# EAGLE design TSAL_3_5_16 (EAGLE 7.5.0)
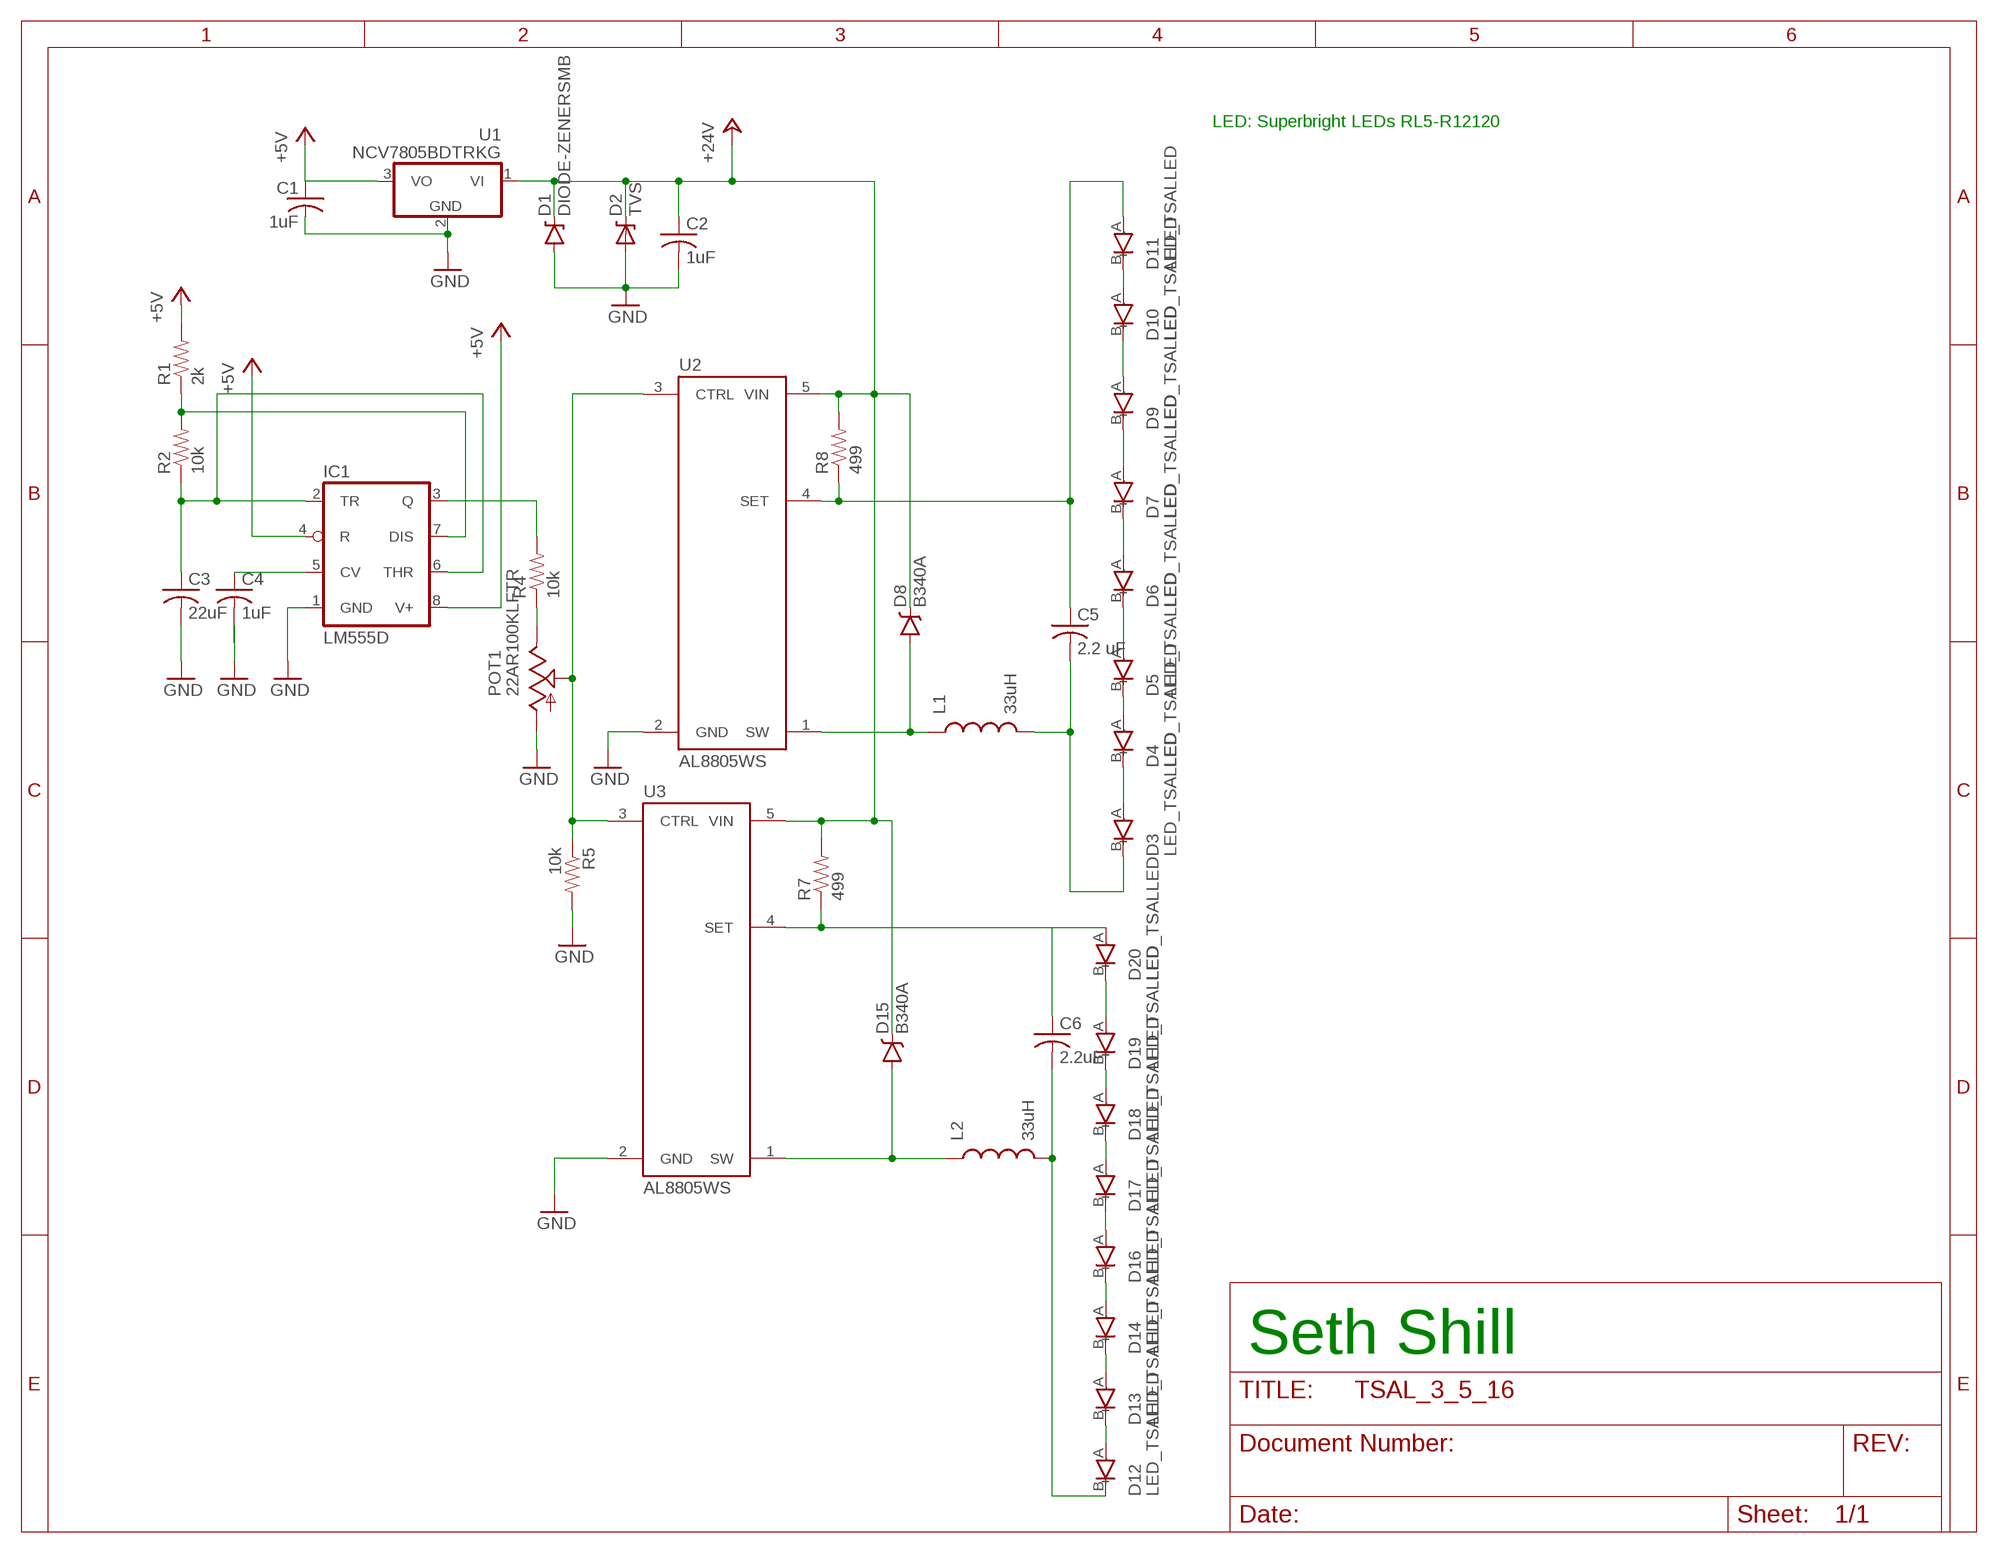
[diagram p0: schematic, sheet 1]

## Parts
C1  1uF  CAP_1UF_50V_0805  [0805@1]
C2  1uF  CAP_1UF_50V_0805  [0805@1]
C3  22uF  CAP_22UF_6.3V_0805  [0805@1]
C4  1uF  CAP_1UF_50V_0805  [0805@1]
C5  2.2 uF  CAP_2.2UF_16V_0603  [0603@1]
C6  2.2uF  CAP_2.2UF_16V_0603  [0603@1]
D1  DIODE-ZENERSMB  [SMB-DIODE]
D2  TVS  [DO-214AC]
D3  LED_TSALLED  [LED_TSAL]
D4  LED_TSALLED  [LED_TSAL]
D5  LED_TSALLED  [LED_TSAL]
D6  LED_TSALLED  [LED_TSAL]
D7  LED_TSALLED  [LED_TSAL]
D8  B340A  DIODE-SCHOTTKY-B340A  [SMA-DIODE]
D9  LED_TSALLED  [LED_TSAL]
D10  LED_TSALLED  [LED_TSAL]
D11  LED_TSALLED  [LED_TSAL]
D12  LED_TSALLED  [LED_TSAL]
D13  LED_TSALLED  [LED_TSAL]
D14  LED_TSALLED  [LED_TSAL]
D15  B340A  DIODE-SCHOTTKY-B340A  [SMA-DIODE]
D16  LED_TSALLED  [LED_TSAL]
D17  LED_TSALLED  [LED_TSAL]
D18  LED_TSALLED  [LED_TSAL]
D19  LED_TSALLED  [LED_TSAL]
D20  LED_TSALLED  [LED_TSAL]
IC1  LM555D  [SO08]
L1  33uH  INDUCTOR1007  [1007]
L2  33uH  INDUCTOR1007  [1007]
POT1  22AR100KLFTR  [22AR100KLFTR]
R1  2k  RES_2K_1%_0805  [0805@1]
R2  10k  RES_10K_1%_0805  [0805@1]
R4  10k  RES_10K_1%_0805  [0805@1]
R5  10k  RES_10K_1%_0805  [0805@1]
R7  499  RES_499_1%  [0603@1]
R8  499  RES_499_1%  [0603@1]
U1  NCV7805BDTRKG  [DPAK]
U2  AL8805WS  AL8805  [SOT23-5]
U3  AL8805WS  AL8805  [SOT23-5]

## Nets
+5V: C1.1(+) IC1.4(R) IC1.8(V+) R1.2 U1.3(VO)
+24V: C2.1(+) D1.C D2.C D8.C D15.C R7.2 R8.2 U1.1(VI) U2.5(VIN) U3.5(VIN)
GND: C1.2(-) C2.2(-) C3.2(-) C4.2(-) D1.A D2.A IC1.1(GND) POT1.3(CW) R5.2 U1.2(GND) U2.2(GND) U3.2(GND)
N$1: C6.1(+) D20.A(+) R7.1 U3.4(SET)
N$2: POT1.2(W) R5.1 U2.3(CTRL) U3.3(CTRL)
N$3: D17.A(+) D18.B(-)
N$4: C4.1(+) IC1.5(CV)
N$5: IC1.7(DIS) R1.1 R2.2
N$7: D15.A L2.1 U3.1(SW)
N$8: C5.1(+) D11.A(+) R8.1 U2.4(SET)
N$9: D10.A(+) D11.B(-)
N$10: C3.1(+) IC1.2(TR) IC1.6(THR) R2.1
N$11: D18.A(+) D19.B(-)
N$12: D9.A(+) D10.B(-)
N$13: D7.A(+) D9.B(-)
N$14: C6.2(-) D12.B(-) L2.2
N$15: D6.A(+) D7.B(-)
N$16: D5.A(+) D6.B(-)
N$17: D19.A(+) D20.B(-)
N$18: D12.A(+) D13.B(-)
N$19: C5.2(-) D3.B(-) L1.2
N$20: D13.A(+) D14.B(-)
N$21: D16.A(+) D17.B(-)
N$22: D14.A(+) D16.B(-)
N$23: D4.A(+) D5.B(-)
N$24: D3.A(+) D4.B(-)
N$26: D8.A L1.1 U2.1(SW)
N$27: POT1.1(CCW) R4.1
N$28: IC1.3(Q) R4.2

## Notes on the sheet
- LED: Superbright LEDs RL5-R12120
- Seth Shill

## Library data of the parts
C1 C2 C4 = FSAE Electric:CAP; PARTNO: UMK212F105ZG-T
C3 = FSAE Electric:CAP; PARTNO: CL21A226MQCLQNC
C5 C6 = FSAE Electric:CAP; PARTNO: EMK107F225ZA-T
D1 = FSAE Electric:DIODE-ZENER: Zener Diode Production Part - 8199 3.4V Zener Voltage
D2 = FSAE Electric:TVS: Diode
D3-D7 D9-D14 D16-D20 = FSAE Electric:LED_TSAL
D8 D15 = FSAE Electric:DIODE-SCHOTTKY: Schottky diodes in SFE's production catalog BAT20J 1A 23V 0.62Vf RB751 120mA 40V 0.37Vf PMEG4005EJ 0.5A 40V 0.42Vf MBRA140 1A 40V 0.5Vf B340A 3A 40V SMA; PROD_ID: DIO-09886
IC1 = FSAE Electric:*555: TIMER
L1 L2 = FSAE Electric:INDUCTOR: Inductors Basic Inductor/Choke - 0603 and 1206. Footprints are not proven and vary greatly between part numbers. INDUCTOR POWER 3.3UH 4.0A SMD 0.197" L x 0.197" W x 0.177" H (5.00mm x 5.00mm x 4.50mm); PARTNO: CB2518T330K
POT1 = FSAE Electric:22AR100KLFTR; PARTNO: 22AR100KLFTR
R1 = FSAE Electric:RES: Resistors; PARTNO: RC0805FR-072KL
R2 R4 R5 = FSAE Electric:RES: Resistors; PARTNO: RC0805FR-0710KL
R7 R8 = FSAE Electric:RES: Resistors; PARTNO: RC0603FR-07499RL
U1 = FSAE Electric:NCV7805BDTRKG; PARTNO: NCV7805BDTRKG
U2 U3 = FSAE Electric:AL8805: Constant current LED driver PWM-able 1MHz switch freq 6V-36V Up to 1A LED current; PROD_ID: IC-11626

## Board
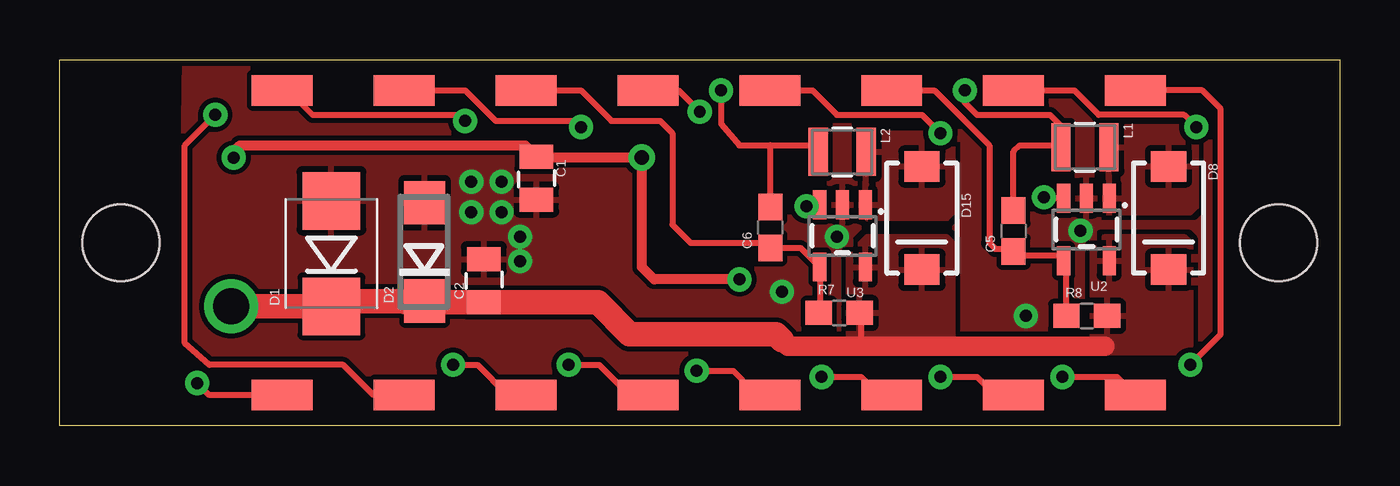
[diagram p1: board, top side]
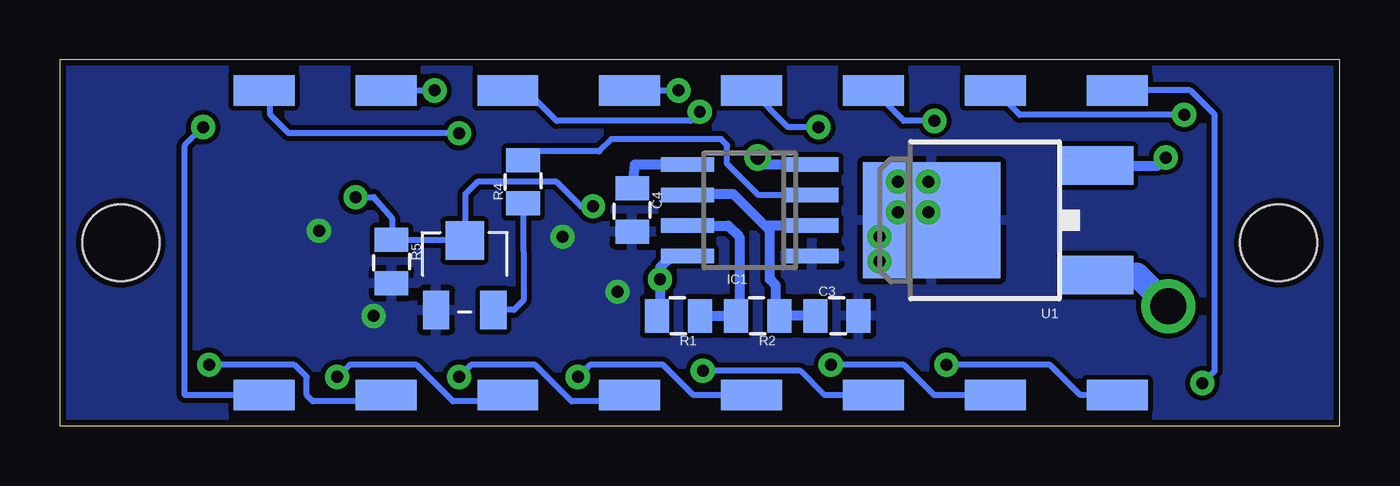
[diagram p2: board, bottom side, seen from below]

Size 53.34 x 15.24 mm. Coordinates in mm from the lower left corner, seen from the top.
Outline: 0,0 0,15.24 53.34,15.24 53.34,0 0,0
Copper layers (1*16): Top 0.035mm / dielectric 1.5mm / Bottom 0.035mm
Design rules "SparkFun *": minimum track width 8mil, minimum drill 18mil, track to track 8mil, track to pad 8mil, pad to pad 8mil, via to via 8mil, smd to smd 8mil, copper to edge 10mil, drill to drill 8mil, minimum pad ring 12mil, minimum via ring 10mil, stop-mask expansion 4mil, vias tented up to drill 25mil, thermal gap 10mil
Holes 3.2 mm at 2.54,7.62 50.8,7.62

### Footprints (pad centres in the part's own frame; a part is rotated, then mirrored left to right if it is on the bottom)
0805@1 = smd 1 x 1.4: 1 -0.9,0; 2 0.9,0
0603@1 = smd 1.1 x 1: 1 -0.85,0; 2 0.85,0
SMB-DIODE = smd 2.4 x 2.4: A 2.2,0; C -2.2,0
DO-214AC = smd 1.8 x 1.7: A 2.05,0; C -2.05,0
LED_TSAL = smd 2.54 x 1.27: A 0,0 | smd 2.54 x 1.27 bottom: B 0,0
SMA-DIODE = smd 1.27 x 1.47: A -2.15,0; C 2.15,0
SO08 = smd 0.6 x 2.2: 1 -1.905,-2.6; 2 -0.635,-2.6; 3 0.635,-2.6; 4 1.905,-2.6; 5 1.905,2.6; 6 0.635,2.6; 7 -0.635,2.6; 8 -1.905,2.6
1007 = smd 2 x 0.8: 1 0,1; 2 0,-1
22AR100KLFTR = smd 1.092 x 1.6: 1 1.194,-1.448; 3 -1.194,-1.448 | smd 1.6 x 1.6: 2 0,1.448
DPAK = smd 1.6 x 3: 1 -2.28,-4.04; 3 2.28,-4.04 | smd 4.826 x 5.715: 2 0,2.858
SOT23-5 = smd 0.55 x 1.2: 1 -0.95,-1.3; 2 0,-1.3; 3 0.95,-1.3; 4 0.95,1.3; 5 -0.95,1.3

### Placement (x,y rotation side)
C1  19.86,10.32 270 top
C2  17.67,6.04 90 top
C3  20.95,4.57 0 bottom
C4  29.48,8.99 270 bottom
C5  39.75,8.12 90 top
C6  29.61,8.26 90 top
D1  11.31,7.17 90 top
D2  15.2,7.25 90 top
D3  39.75,13.97 0 top
D4  44.83,1.27 0 top
D5  34.67,1.27 0 top
D6  24.51,1.27 0 top
D7  14.35,1.27 0 top
D8  46.21,8.65 270 top
D9  14.35,13.97 0 top
D10  24.51,13.97 0 top
D11  34.67,13.97 0 top
D12  29.59,13.97 0 top
D13  44.83,13.97 0 top
D14  39.75,1.27 0 top
D15  35.93,8.65 270 top
D16  29.59,1.27 0 top
D17  19.43,1.27 0 top
D18  9.27,1.27 0 top
D19  9.27,13.97 180 top
D20  19.43,13.97 0 top
IC1  24.59,8.97 90 bottom
L1  42.73,11.61 270 top
L2  32.61,11.41 270 top
POT1  36.47,6.27 0 bottom
R1  27.56,4.57 180 bottom
R2  24.26,4.57 180 bottom
R4  34.04,10.16 90 bottom
R5  39.52,6.84 270 bottom
R7  32.49,4.7 0 top
R8  42.8,4.57 0 top
U1  14.15,8.56 90 bottom
U2  42.79,8.18 180 top
U3  32.62,7.91 180 top

### Tracks (layer width: path | path; a pad name or v marks a point on that pad's centre or on a via)
+5V  (via drill 0.5, 0.6)
  Top 0.406: v28.32,6.1 24.77,6.1 24.26,6.6 v24.26,11.18 19.9,11.18 C1.1 19.39,11.68 7.49,11.68 7.24,11.43 v7.24,11.18
  Bottom 0.406: R1.2 28.32,4.71 v28.32,6.1 28.32,6.6 27.86,7.07 IC1.8 | IC1.4 23.96,10.88 v24.26,11.18 | U1.3 7.57,10.84 v7.24,11.18
+24V  (via drill 1.5)
  Top 0.254: 33.4,3.3 33.4,4.64 R7.2
  Top 0.813: 30.1,3.56 30.35,3.3 33.4,3.3 43.56,3.3
  Top 1.016: D1.C 10.54,4.97 | 10.54,4.97 v7.14,4.97 v7.14,4.98 | D2.C 14.35,5.2 | 14.35,5.2 10.77,5.2 10.54,4.97 | 14.35,5.2 14.41,5.14 C2.1 22.42,5.14 23.75,3.81 29.84,3.81 30.1,3.56
  Bottom 1.016: U1.1 8.44,6.28 v7.14,4.98
  pour Top: 32.89,7.11 33.66,7.87 36.96,7.87 37.21,7.62 37.21,3.3 32.89,3.3
  pour Top: 43.05,3.05 43.05,7.37 43.56,7.87 46.86,7.87 47.12,7.62 47.12,3.3 46.86,3.05
GND  (via drill 0.5)
  other vias: 17.14,10.16 18.41,10.16 17.14,8.89 18.41,8.89 19.18,7.87 19.18,6.86 32.38,7.87 30.1,5.59 40.26,4.57 42.55,8.13
  pour Top (rank 6): 4.95,0 48.26,0 48.26,14.99 5.21,15.24
  pour Bottom: 0,15.24 0,0 53.34,0 53.34,15.24
N$1
  Top 0.254: D20.A 21.72,13.97 22.99,12.7 25.02,12.7 25.53,12.19 25.53,8.38 26.29,7.62 29.66,7.62 C6.1 30.87,7.41 U3.4 31.67,4.74 R7.1
N$2  (via drill 0.5)
  Top 0.254: U2.3 41.35,9.47 v41.02,9.53 | U3.3 31.18,9.21 v31.11,9.14
  Bottom 0.254: v41.02,9.53 40.26,9.53 39.5,8.64 39.5,7.76 R5.1 36.49,7.74 POT1.2 36.45,7.74 36.45,9.65 35.94,10.16 32.64,10.16 31.62,9.14 v31.11,9.14
N$3  (via drill 0.5)
  Top 0.254: v16.38,2.54 17.4,2.54 18.67,1.27 D17.A
  Bottom 0.254: D18.B 10.79,1.27 12.06,2.54 v16.38,2.54
N$4
  Bottom 0.406: IC1.5 29.38,10.88 C4.1
N$5
  Bottom 0.406: R1.1 R2.2 25.02,4.71 25.02,7.87 25.48,8.34 IC1.7
N$7
  pour Top: 33.4,12.19 36.96,12.19 37.21,11.94 37.21,8.89 36.96,8.64 33.66,8.64 33.4,8.89
N$8
  Top 0.254: D11.A 36.45,13.97 38.73,11.68 38.73,7.62 38.99,7.37 39.91,7.37 C5.1 39.75,7.11 40.01,7.11 41.6,7.11 U2.4 41.95,6.76 R8.1
N$9  (via drill 0.5)
  Top 0.254: D10.A 25.78,13.97 v26.67,13.08
  Bottom 0.254: D11.B 33.91,13.97 32.64,12.7 27.05,12.7 v26.67,13.08
N$10
  Bottom 0.406: IC1.2 23.96,8.34 | 23.96,8.34 25.27,9.65 27.14,9.65 IC1.6 | R2.1 C3.1 23.5,4.57 23.5,5.84 23.75,6.1 23.75,8.13 23.96,8.34
N$11  (via drill 0.5)
  Top 0.254: D18.A 6.22,1.27 v5.71,1.78
  Bottom 0.254: v5.71,1.78 5.21,2.29 5.21,12.95 6.22,13.97 D19.B
N$12  (via drill 0.5)
  Top 0.254: D9.A 16.89,13.97 18.16,12.7 21.46,12.7 v21.72,12.45
  Bottom 0.254: v21.72,12.45 22.99,12.45 D10.B
N$13  (via drill 0.5)
  Top 0.254: D7.A 13.08,1.27 11.81,2.54 6.22,2.54 5.21,3.43 5.21,11.68 v6.48,12.95
  Bottom 0.254: v6.48,12.95 13.34,12.95 D9.B
N$14  (via drill 0.5)
  Top 0.254: v27.56,13.97 27.56,12.57 28.32,11.68 29.84,11.68 | 29.84,11.68 31.33,11.68 L2.2 | C6.2 29.61,11.71 29.84,11.68
  Bottom 0.254: D12.B v27.56,13.97
N$15  (via drill 0.5)
  Top 0.254: v21.21,2.54 22.48,2.54 23.75,1.27 D6.A
  Bottom 0.254: 13.84,1.27 D7.B 16.89,1.27 18.16,2.54 v21.21,2.54
N$16  (via drill 0.5)
  Top 0.254: v31.75,2.03 33.4,2.03 33.91,1.52 34.42,1.52 D5.A
  Bottom 0.254: D6.B 26.92,1.27 28.19,2.54 31.24,2.54 v31.75,2.03
N$17  (via drill 0.5)
  Top 0.254: D19.A 9.53,13.97 10.54,12.95 16.64,12.95 v16.89,12.7
  Bottom 0.254: v16.89,12.7 18.16,12.7 D20.B
N$18  (via drill 0.5)
  Top 0.254: D12.A 31.37,13.97 32.38,12.95 35.94,12.95 v36.7,12.19
  Bottom 0.254: v36.7,12.19 43.81,12.19 44.58,12.95 44.58,13.72 D13.B
N$19  (via drill 0.5)
  Top 0.254: v37.72,13.97 37.72,13.46 38.23,12.95 41.27,12.95 41.78,12.45 41.78,11.66 L1.2 41.65,11.68 40.01,11.68 39.75,11.43 39.75,9.15 40.01,9.14 C5.2
  Bottom 0.254: D3.B v37.72,13.97
N$20  (via drill 0.5)
  Top 0.254: v47.12,2.54 48.39,3.81 48.39,13.21 47.62,13.97 D13.A
  Bottom 0.254: D14.B 40.51,1.27 40.77,1.02 42.8,1.02 43.05,1.27 43.05,2.03 43.56,2.54 v47.12,2.54
N$21  (via drill 0.5)
  Top 0.254: v26.54,2.29 28.07,2.29 28.83,1.52 29.34,1.52 D16.A
  Bottom 0.254: D17.B 21.46,1.27 22.48,2.29 v26.54,2.29
N$22  (via drill 0.5)
  Top 0.254: v36.7,2.03 38.23,2.03 38.99,1.27 D14.A
  Bottom 0.254: D16.B 30.1,1.27 30.35,1.02 32,1.02 33.53,2.54 36.2,2.54 v36.7,2.03
N$23  (via drill 0.5)
  Top 0.254: v41.78,2.03 44.07,2.03 D4.A
  Bottom 0.254: D5.B 35.43,1.27 35.69,1.02 36.96,1.02 38.48,2.54 41.27,2.54 v41.78,2.03
N$24  (via drill 0.5)
  Top 0.254: D3.A 42.29,13.97 43.31,12.95 46.86,12.95 v47.37,12.45
  Bottom 0.254: D4.B 48.13,1.27 48.13,11.68 v47.37,12.45
N$26
  pour Top: 43.56,8.89 47.12,8.89 47.37,9.14 47.37,12.19 47.12,12.45 43.56,12.45
N$27
  Bottom 0.254: R4.1 34.02,5.23 34.42,4.83 POT1.1
N$28
  Bottom 0.254: IC1.3 24.21,9.61 25.53,10.92 25.53,11.68 25.78,11.94 30.35,11.94 30.86,11.43 33.59,11.43 R4.2